# Altium schematic sheet kitpic.SchDoc
size A4
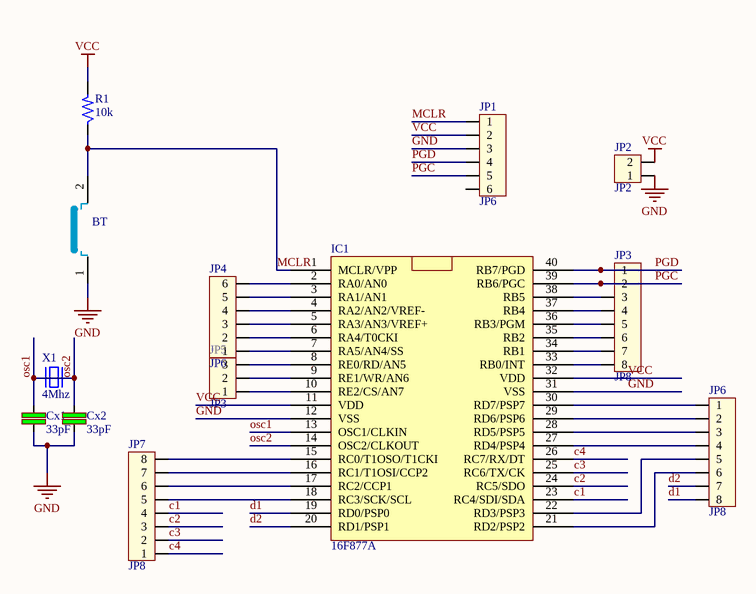
[diagram p0: kitpic.SchDoc]

## Parts
BT1  BT  [SW4]
Cx1  33pF  [CN1]
Cx2  33pF  [CN1]
IC1  16F877A  [DIP40/W0.6]
JP1  JP6  [CON6]
JP2  JP2  [CON2]
JP3  JP8  [CON8]
JP4  JP6  [CON6]
JP5  JP3  [CON3]
JP6  JP8  [CON8]
JP7  JP8  [CON8]
R1  10k  [R1/4W]
X1  4Mhz  [XT2]

## Nets
GND: BT1.1 Cx1.1 Cx2.1 IC1.12(VSS) IC1.31(VSS) JP1.3 JP2.1
VCC: IC1.11(VDD) IC1.32(VDD) JP1.2 JP2.2 R1.2
c1: IC1.23(RC4/SDI/SDA) JP7.4
c2: IC1.24(RC5/SDO) JP7.3
c3: IC1.25(RC6/TX/CK) JP7.2
c4: IC1.26(RC7/RX/DT) JP7.1
d1: IC1.19(RD0/PSP0) JP6.8
d2: IC1.20(RD1/PSP1) JP6.7
MCLR: BT1.2 IC1.1(MCLR/VPP) JP1.1 R1.1
osc1: Cx1.2 Cx2.2 IC1.13(OSC1/CLKIN) IC1.14(OSC2/CLKOUT) X1.1 X1.2  [also labelled osc2]
PGC: IC1.39(RB6/PGC) JP1.5 JP3.2
PGD: IC1.40(RB7/PGD) JP1.4 JP3.1
NetIC1_2: IC1.2(RA0/AN0) JP4.6
NetIC1_3: IC1.3(RA1/AN1) JP4.5
NetIC1_4: IC1.4(RA2/AN2/VREF-) JP4.4
NetIC1_5: IC1.5(RA3/AN3/VREF+) JP4.3
NetIC1_6: IC1.6(RA4/T0CKI) JP4.2
NetIC1_7: IC1.7(RA5/AN4/SS) JP4.1
NetIC1_8: IC1.8(RE0/RD/AN5) JP5.3
NetIC1_9: IC1.9(RE1/WR/AN6) JP5.2
NetIC1_10: IC1.10(RE2/CS/AN7) JP5.1
NetIC1_15: IC1.15(RC0/T1OSO/T1CKI) JP7.8
NetIC1_16: IC1.16(RC1/T1OSI/CCP2) JP7.7
NetIC1_17: IC1.17(RC2/CCP1) JP7.6
NetIC1_18: IC1.18(RC3/SCK/SCL) JP7.5
NetIC1_21: IC1.21(RD2/PSP2) JP6.6
NetIC1_22: IC1.22(RD3/PSP3) JP6.5
NetIC1_27: IC1.27(RD4/PSP4) JP6.4
NetIC1_28: IC1.28(RD5/PSP5) JP6.3
NetIC1_29: IC1.29(RD6/PSP6) JP6.2
NetIC1_30: IC1.30(RD7/PSP7) JP6.1
NetIC1_33: IC1.33(RB0/INT) JP3.8
NetIC1_34: IC1.34(RB1) JP3.7
NetIC1_35: IC1.35(RB2) JP3.6
NetIC1_36: IC1.36(RB3/PGM) JP3.5
NetIC1_37: IC1.37(RB4) JP3.4
NetIC1_38: IC1.38(RB5) JP3.3

Not connected (* = marked no-connect by the designer): JP1 6

## Library data of the parts
BT1 = BUTTON
Cx1 Cx2 = CN0: Cremic For Xtal 1pF => 100pF; Value: 33pF
IC1 = PIC 16F877A
JP1 JP4 = Con6: Connector 6; Value: Connector 6
JP2 = Con2: Connector 2; Value: Connector 2
JP3 JP6 JP7 = Con8: Connector 8; Value: Connector 8
JP5 = Con3: Connector 3; Value: Connector 3
R1 = Res
X1 = XT2: Crystal For all Crystal 2pin.; Value: 4Mhz